# Altium project Connected_Cube.PrjPcb
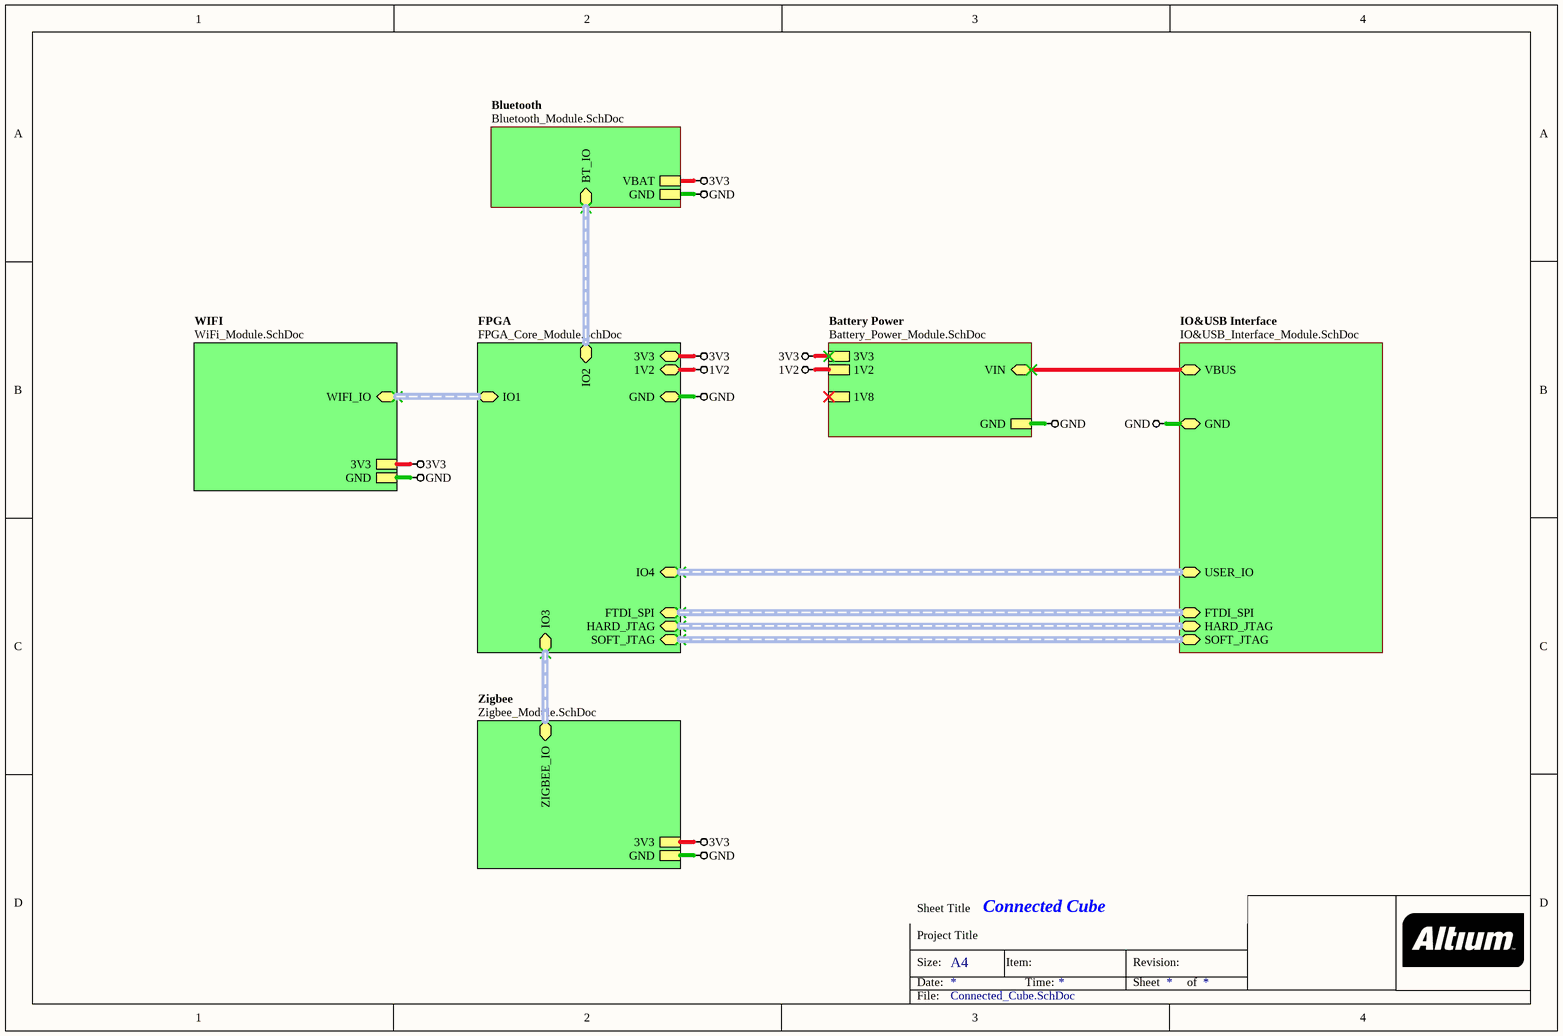
[diagram p0: Connected_Cube.SchDoc]
7 sheets, 1 parts. Net scope: hierarchical (ports join the sheet entries above them; power ports are global).
Board file: Connected_Cube.PcbDoc
Sheets:
  Connected_Cube.SchDoc
    FPGA = FPGA_Core_Module.SchDoc
    Zigbee = Zigbee_Module.SchDoc
    Battery Power = Battery_Power_Module.SchDoc
    IO&USB Interface = IO&USB_Interface_Module.SchDoc
    WIFI = WiFi_Module.SchDoc
    Bluetooth = Bluetooth_Module.SchDoc

## Sheet Connected_Cube.SchDoc: Connected Cube
size A4

### Sub-sheets
Battery Power = Battery_Power_Module.SchDoc: 3V3, GND, 1V8, 1V2, VIN
Bluetooth = Bluetooth_Module.SchDoc: VBAT, GND, BT_IO (harness SIG4)
FPGA = FPGA_Core_Module.SchDoc: 3V3, 1V2, GND, FTDI_SPI (harness FTDI_SPI), HARD_JTAG (harness JTAG_A), SOFT_JTAG (harness JTAG_A), IO3 (harness SIG20), IO4 (harness SIG10), IO1 (harness SIG8), IO2 (harness SIG4)
IO&USB Interface = IO&USB_Interface_Module.SchDoc: VBUS, GND, HARD_JTAG (harness JTAG_A), SOFT_JTAG (harness JTAG_A), USER_IO (harness SIG10), FTDI_SPI (harness FTDI_SPI)
WIFI = WiFi_Module.SchDoc: 3V3, GND, WIFI_IO (harness SIG8)
Zigbee = Zigbee_Module.SchDoc: 3V3, GND, ZIGBEE_IO (harness SIG20)

### Nets
1V2: sheet FPGA/1V2, sheet Battery Power/1V2
3V3: sheet FPGA/3V3, sheet Zigbee/3V3, sheet Battery Power/3V3, sheet WIFI/3V3, sheet Bluetooth/VBAT
GND: sheet FPGA/GND, sheet Zigbee/GND, sheet Battery Power/GND, sheet IO&USB Interface/GND, sheet WIFI/GND, sheet Bluetooth/GND
VBUS: sheet Battery Power/VIN, sheet IO&USB Interface/VBUS

### Buses and harness runs
harness sheet Bluetooth/BT_IO = sheet FPGA/IO2
harness sheet FPGA/FTDI_SPI = sheet IO&USB Interface/FTDI_SPI
harness sheet FPGA/HARD_JTAG = sheet IO&USB Interface/HARD_JTAG
harness sheet FPGA/IO1 = sheet WIFI/WIFI_IO
harness sheet FPGA/IO3 = sheet Zigbee/ZIGBEE_IO
harness sheet FPGA/IO4 = sheet IO&USB Interface/USER_IO
harness sheet FPGA/SOFT_JTAG = sheet IO&USB Interface/SOFT_JTAG

### Notes on the sheet
- Sheet Title
- Project Title
- Size:
- Date:
- A4
- Item:
- Time:
- Revision:
- Sheet
- of
- File:

## Sheet FPGA_Core_Module.SchDoc: FPGA Core Module
size A4
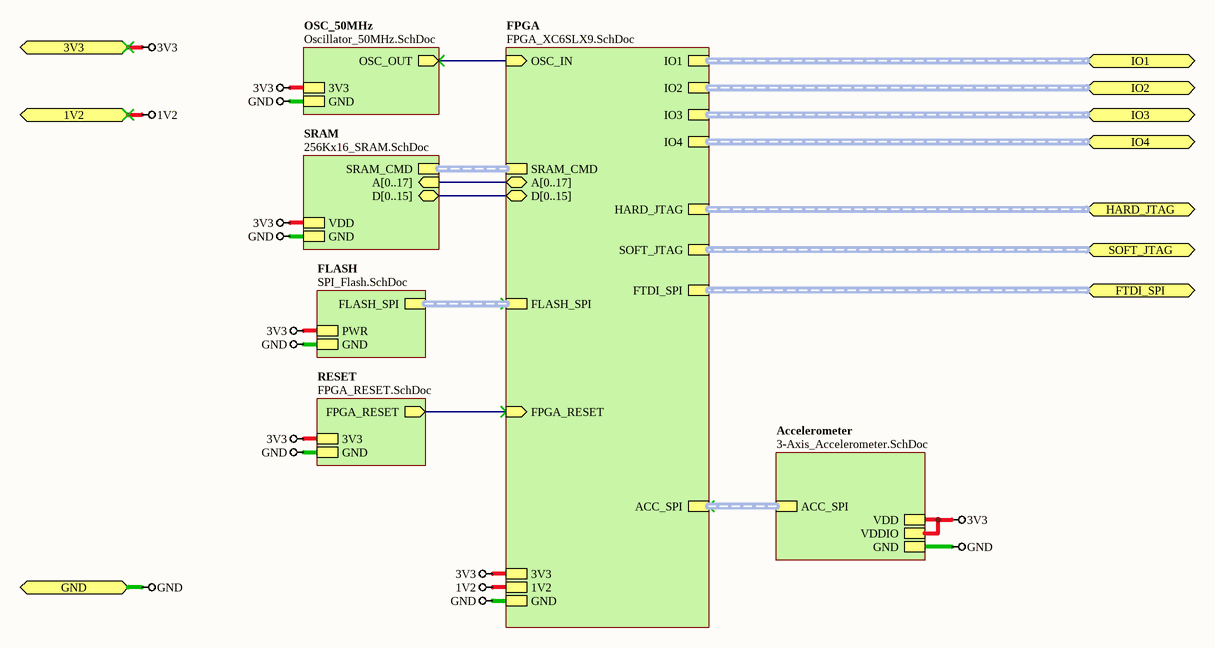
[diagram p1: FPGA_Core_Module.SchDoc]

### Sub-sheets
Accelerometer = 3-Axis_Accelerometer.SchDoc (file not in this document): VDD, VDDIO, GND, ACC_SPI (harness ACC_SPI)
FLASH = SPI_Flash.SchDoc (file not in this document): FLASH_SPI (harness FLASH_SPI), PWR, GND
FPGA = FPGA_XC6SLX9.SchDoc (file not in this document): SRAM_CMD (harness SRAM_CMD), A[0..17] (bidir), D[0..15] (bidir), IO1 (harness SIG8), 3V3, GND, 1V2, OSC_IN (in), FPGA_RESET (in), IO2 (harness SIG4), IO3 (harness SIG20), HARD_JTAG (harness JTAG_A), SOFT_JTAG (harness JTAG_A), FTDI_SPI (harness FTDI_SPI), IO4 (harness SIG10), ACC_SPI (harness ACC_SPI), FLASH_SPI (harness FLASH_SPI)
OSC_50MHz = Oscillator_50MHz.SchDoc (file not in this document): 3V3, OSC_OUT (out), GND
RESET = FPGA_RESET.SchDoc (file not in this document): FPGA_RESET (out), GND, 3V3
SRAM = 256Kx16_SRAM.SchDoc (file not in this document): GND, VDD, A[0..17] (in), D[0..15] (bidir), SRAM_CMD (harness SRAM_CMD)

### Ports
1V2, 3V3, FTDI_SPI (harness FTDI_SPI), GND, HARD_JTAG (harness JTAG_A), IO1 (harness SIG8), IO2 (harness SIG4), IO3 (harness SIG20), IO4 (harness SIG10), SOFT_JTAG (harness JTAG_A)

### Nets
1V2: port 1V2, sheet FPGA/1V2
3V3: port 3V3, sheet RESET/3V3, sheet SRAM/VDD, sheet OSC_50MHz/3V3, sheet FLASH/PWR, sheet Accelerometer/VDD, sheet Accelerometer/VDDIO, sheet FPGA/3V3
GND: port GND, sheet RESET/GND, sheet SRAM/GND, sheet OSC_50MHz/GND, sheet FLASH/GND, sheet Accelerometer/GND, sheet FPGA/GND
(unnamed): sheet RESET/FPGA_RESET, sheet FPGA/FPGA_RESET
(unnamed): sheet OSC_50MHz/OSC_OUT, sheet FPGA/OSC_IN

### Buses and harness runs
bus sheet FPGA/A[0..17] = sheet SRAM/A[0..17]
bus sheet FPGA/D[0..15] = sheet SRAM/D[0..15]
harness port FTDI_SPI = sheet FPGA/FTDI_SPI
harness port HARD_JTAG = sheet FPGA/HARD_JTAG
harness port IO1 = sheet FPGA/IO1
harness port IO2 = sheet FPGA/IO2
harness port IO3 = sheet FPGA/IO3
harness port IO4 = sheet FPGA/IO4
harness port SOFT_JTAG = sheet FPGA/SOFT_JTAG
harness sheet Accelerometer/ACC_SPI = sheet FPGA/ACC_SPI
harness sheet FLASH/FLASH_SPI = sheet FPGA/FLASH_SPI
harness sheet FPGA/SRAM_CMD = sheet SRAM/SRAM_CMD

### Notes on the sheet
- Sheet Title
- Project Title
- Size:
- Date:
- A4
- Item:
- Time:
- Revision:
- Sheet
- of
- File:

## Sheet Zigbee_Module.SchDoc: Zigbee Module
size A4
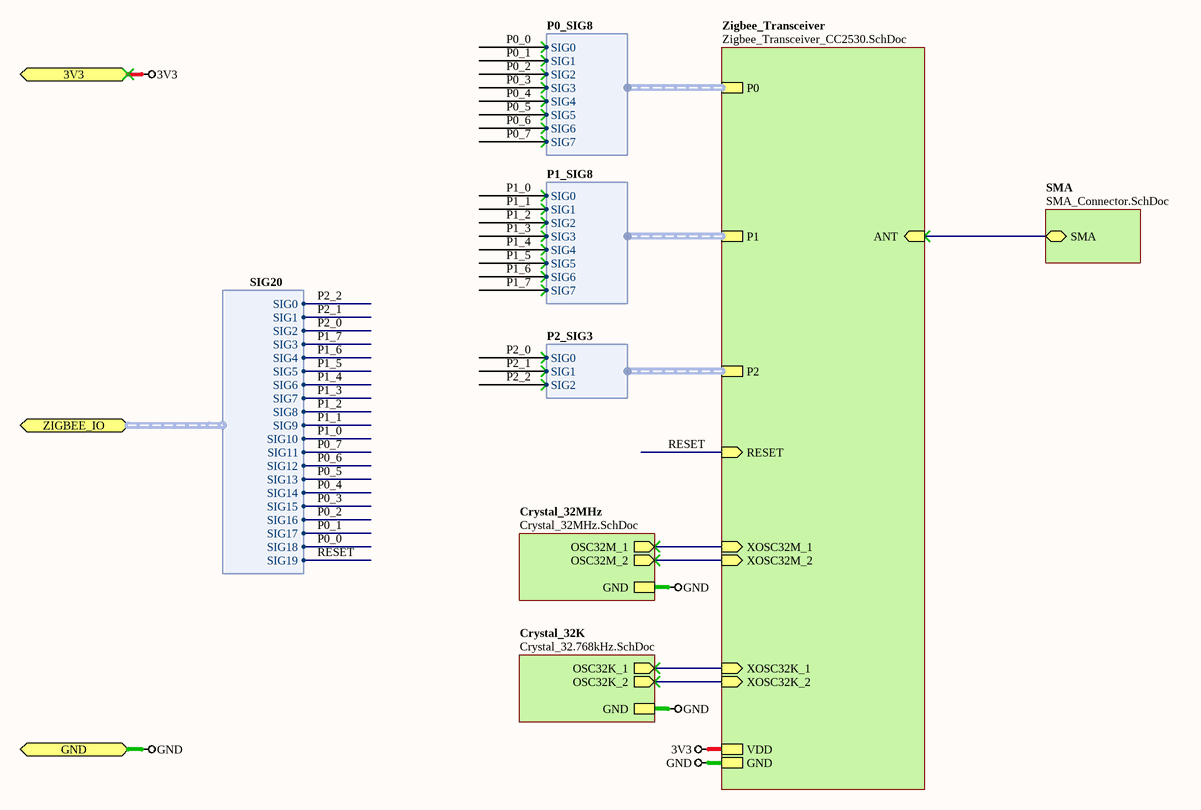
[diagram p2: Zigbee_Module.SchDoc]

### Sub-sheets
Crystal_32K = Crystal_32.768kHz.SchDoc (file not in this document): GND, OSC32K_1 (out), OSC32K_2 (out)
Crystal_32MHz = Crystal_32MHz.SchDoc (file not in this document): OSC32M_1 (out), GND, OSC32M_2 (out)
SMA = SMA_Connector.SchDoc (file not in this document): SMA (bidir)
Zigbee_Transceiver = Zigbee_Transceiver_CC2530.SchDoc (file not in this document): XOSC32M_1 (in), XOSC32M_2 (in), ANT (in), XOSC32K_1 (in), XOSC32K_2 (in), VDD, GND, RESET (in), P0 (harness P0_SIG8), P1 (harness P1_SIG8), P2 (harness P2_SIG3)

### Ports
3V3, GND, ZIGBEE_IO (harness SIG20)

### Harnesses
SIG20: SIG0, SIG1, SIG2, SIG3, SIG4, SIG5, SIG6, SIG7, SIG8, SIG9, SIG10, SIG11, SIG12, SIG13, SIG14, SIG15, SIG16, SIG17, SIG18, SIG19
P0_SIG8: SIG0, SIG1, SIG2, SIG3, SIG4, SIG5, SIG6, SIG7
P1_SIG8: SIG0, SIG1, SIG2, SIG3, SIG4, SIG5, SIG6, SIG7
P2_SIG3: SIG0, SIG1, SIG2

### Nets
3V3: port 3V3, sheet Zigbee_Transceiver/VDD
GND: port GND, sheet Crystal_32K/GND, sheet Crystal_32MHz/GND, sheet Zigbee_Transceiver/GND
P0_0: port ZIGBEE_IO.SIG18, sheet Zigbee_Transceiver/P0.SIG0
P0_1: port ZIGBEE_IO.SIG17, sheet Zigbee_Transceiver/P0.SIG1
P0_2: port ZIGBEE_IO.SIG16, sheet Zigbee_Transceiver/P0.SIG2
P0_3: port ZIGBEE_IO.SIG15, sheet Zigbee_Transceiver/P0.SIG3
P0_4: port ZIGBEE_IO.SIG14, sheet Zigbee_Transceiver/P0.SIG4
P0_5: port ZIGBEE_IO.SIG13, sheet Zigbee_Transceiver/P0.SIG5
P0_6: port ZIGBEE_IO.SIG12, sheet Zigbee_Transceiver/P0.SIG6
P0_7: port ZIGBEE_IO.SIG11, sheet Zigbee_Transceiver/P0.SIG7
P1_0: port ZIGBEE_IO.SIG10, sheet Zigbee_Transceiver/P1.SIG0
P1_1: port ZIGBEE_IO.SIG9, sheet Zigbee_Transceiver/P1.SIG1
P1_2: port ZIGBEE_IO.SIG8, sheet Zigbee_Transceiver/P1.SIG2
P1_3: port ZIGBEE_IO.SIG7, sheet Zigbee_Transceiver/P1.SIG3
P1_4: port ZIGBEE_IO.SIG6, sheet Zigbee_Transceiver/P1.SIG4
P1_5: port ZIGBEE_IO.SIG5, sheet Zigbee_Transceiver/P1.SIG5
P1_6: port ZIGBEE_IO.SIG4, sheet Zigbee_Transceiver/P1.SIG6
P1_7: port ZIGBEE_IO.SIG3, sheet Zigbee_Transceiver/P1.SIG7
P2_0: port ZIGBEE_IO.SIG2, sheet Zigbee_Transceiver/P2.SIG0
P2_1: port ZIGBEE_IO.SIG1, sheet Zigbee_Transceiver/P2.SIG1
P2_2: port ZIGBEE_IO.SIG0, sheet Zigbee_Transceiver/P2.SIG2
RESET: sheet Zigbee_Transceiver/RESET, port ZIGBEE_IO.SIG19
(unnamed): sheet SMA/SMA, sheet Zigbee_Transceiver/ANT
(unnamed): sheet Crystal_32K/OSC32K_1, sheet Zigbee_Transceiver/XOSC32K_1
(unnamed): sheet Crystal_32K/OSC32K_2, sheet Zigbee_Transceiver/XOSC32K_2
(unnamed): sheet Crystal_32MHz/OSC32M_1, sheet Zigbee_Transceiver/XOSC32M_1
(unnamed): sheet Crystal_32MHz/OSC32M_2, sheet Zigbee_Transceiver/XOSC32M_2

### Notes on the sheet
- Sheet Title
- Project Title
- Size:
- Date:
- A4
- Item:
- Time:
- Revision:
- Sheet
- of
- File:

## Sheet Battery_Power_Module.SchDoc: Battery Power Module
size A4
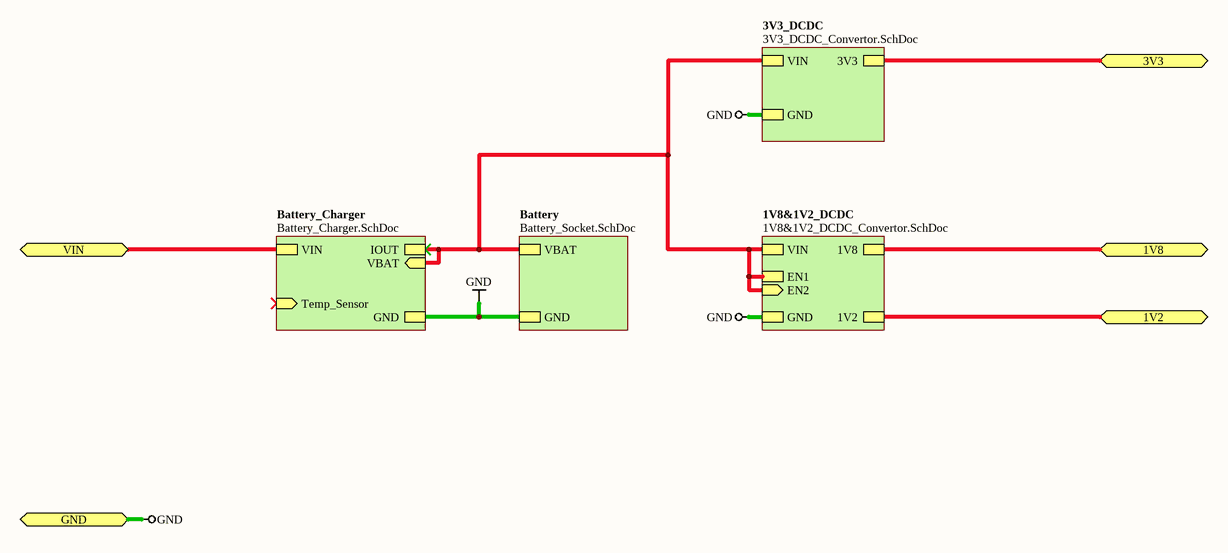
[diagram p3: Battery_Power_Module.SchDoc]

### Sub-sheets
1V8&1V2_DCDC = 1V8&1V2_DCDC_Convertor.SchDoc (file not in this document): VIN, EN1, EN2 (in), GND, 1V8, 1V2
3V3_DCDC = 3V3_DCDC_Convertor.SchDoc (file not in this document): VIN, GND, 3V3
Battery = Battery_Socket.SchDoc (file not in this document): VBAT, GND
Battery_Charger = Battery_Charger.SchDoc (file not in this document): VIN, GND, Temp_Sensor (in), VBAT (in), IOUT

### Ports
1V2, 1V8, 3V3, GND, VIN

### Nets
1V2: port 1V2, sheet 1V8&1V2_DCDC/1V2
3V3: port 3V3, sheet 3V3_DCDC/3V3
GND: port GND, sheet 3V3_DCDC/GND, sheet 1V8&1V2_DCDC/GND, sheet Battery/GND, sheet Battery_Charger/GND
VBUS: port VIN, sheet Battery_Charger/VIN
(unnamed): port 1V8, sheet 1V8&1V2_DCDC/1V8
(unnamed): sheet 3V3_DCDC/VIN, sheet 1V8&1V2_DCDC/VIN, sheet 1V8&1V2_DCDC/EN1, sheet 1V8&1V2_DCDC/EN2, sheet Battery/VBAT, sheet Battery_Charger/VBAT, sheet Battery_Charger/IOUT

### Notes on the sheet
- Sheet Title
- Project Title
- Size:
- Date:
- A4
- Item:
- Time:
- Revision:
- Sheet
- of
- File:

## Sheet IO&USB_Interface_Module.SchDoc: IO&USB Interface Module
size A4
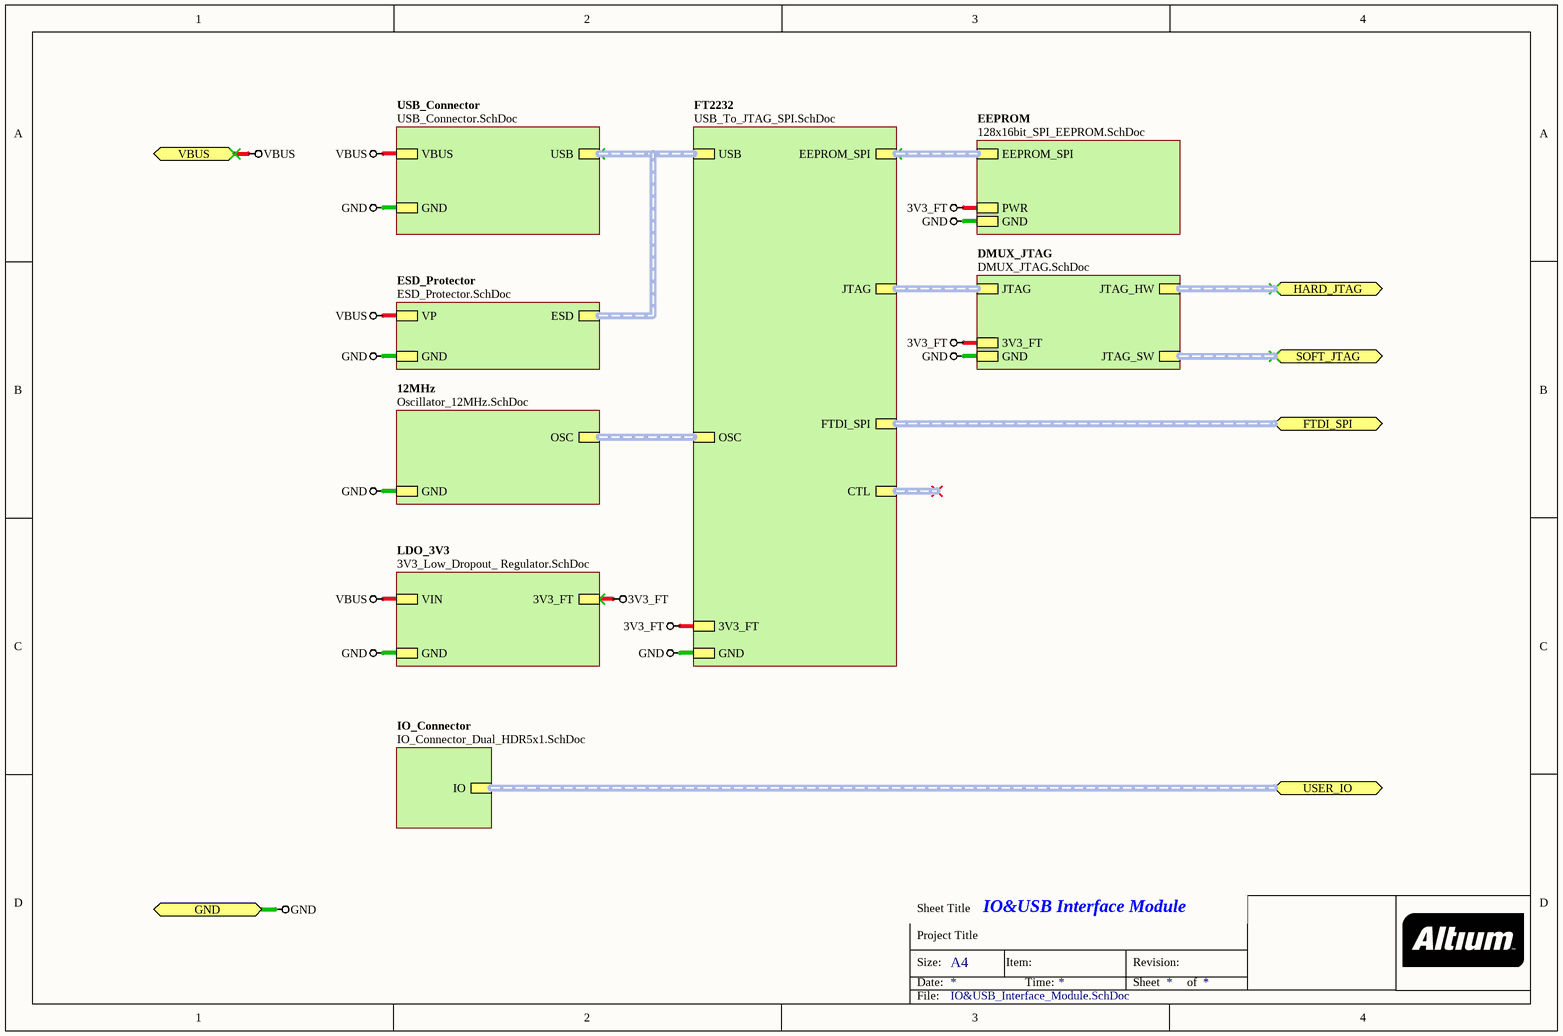
[diagram p4: IO&USB_Interface_Module.SchDoc]

### Sub-sheets
12MHz = Oscillator_12MHz.SchDoc (file not in this document): OSC (harness OSC), GND
DMUX_JTAG = DMUX_JTAG.SchDoc (file not in this document): JTAG_SW (harness JTAG_SW), JTAG_HW (harness JTAG_HW), GND, 3V3_FT, JTAG (harness JTAG)
EEPROM = 128x16bit_SPI_EEPROM.SchDoc (file not in this document): EEPROM_SPI (harness FTDI_SPI), GND, PWR
ESD_Protector = ESD_Protector.SchDoc (file not in this document): VP, GND, ESD (harness USB)
FT2232 = USB_To_JTAG_SPI.SchDoc (file not in this document): USB (harness USB), EEPROM_SPI (harness EEPROM_SPI), 3V3_FT, GND, OSC (harness OSC), FTDI_SPI (harness FTDI_SPI), JTAG (harness JTAG), CTL (harness CTL)
IO_Connector = IO_Connector_Dual_HDR5x1.SchDoc (file not in this document): IO (harness SIG10)
LDO_3V3 = 3V3_Low_Dropout_ Regulator.SchDoc (file not in this document): 3V3_FT, VIN, GND
USB_Connector = USB_Connector.SchDoc (file not in this document): VBUS, GND, USB (harness USB)

### Ports
FTDI_SPI (harness FTDI_SPI), GND, HARD_JTAG (harness JTAG_A), SOFT_JTAG (harness JTAG_A), USER_IO (harness SIG10), VBUS

### Nets
3V3_FT: sheet FT2232/3V3_FT, sheet DMUX_JTAG/3V3_FT, sheet EEPROM/PWR, sheet LDO_3V3/3V3_FT
GND: port GND, sheet FT2232/GND, sheet 12MHz/GND, sheet DMUX_JTAG/GND, sheet EEPROM/GND, sheet LDO_3V3/GND, sheet USB_Connector/GND, sheet ESD_Protector/GND
VBUS: port VBUS, sheet LDO_3V3/VIN, sheet USB_Connector/VBUS, sheet ESD_Protector/VP

### Buses and harness runs
harness port FTDI_SPI = sheet FT2232/FTDI_SPI
harness port HARD_JTAG = sheet DMUX_JTAG/JTAG_HW
harness port SOFT_JTAG = sheet DMUX_JTAG/JTAG_SW
harness port USER_IO = sheet IO_Connector/IO
harness sheet 12MHz/OSC = sheet FT2232/OSC
harness sheet DMUX_JTAG/JTAG = sheet FT2232/JTAG
harness sheet EEPROM/EEPROM_SPI = sheet FT2232/EEPROM_SPI
harness sheet ESD_Protector/ESD = sheet FT2232/USB = sheet USB_Connector/USB

### Notes on the sheet
- Sheet Title
- Project Title
- Size:
- Date:
- A4
- Item:
- Time:
- Revision:
- Sheet
- of
- File:

## Sheet WiFi_Module.SchDoc: WiFi Module
size A4
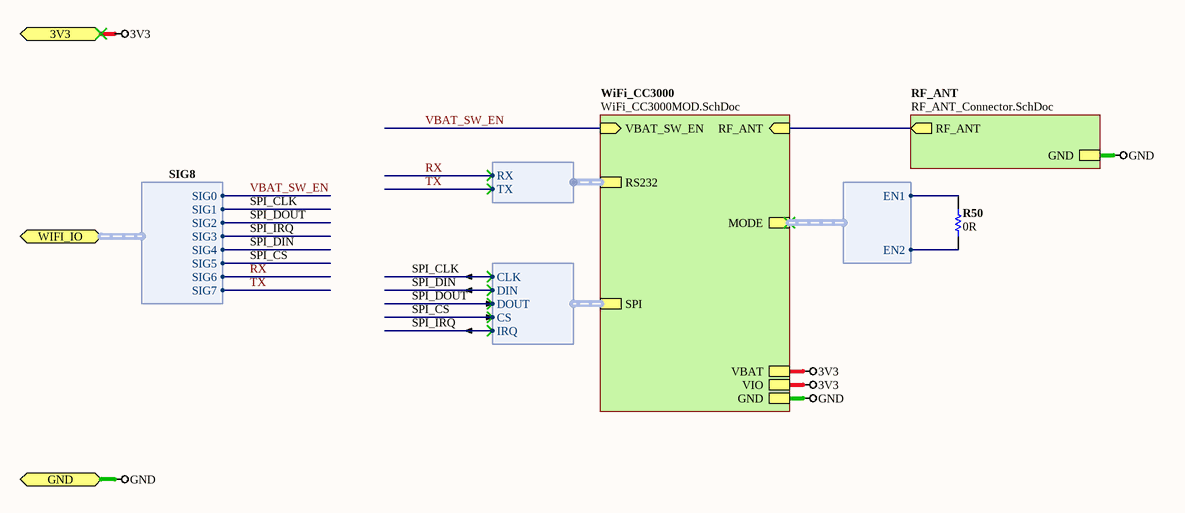
[diagram p5: WiFi_Module.SchDoc]

### Parts
R50  0R  [RESC0402(1005)_N]

### Sub-sheets
RF_ANT = RF_ANT_Connector.SchDoc (file not in this document): RF_ANT (out), GND
WiFi_CC3000 = WiFi_CC3000MOD.SchDoc (file not in this document): GND, VBAT, RS232 (harness RS232), SPI (harness SPI_CC3000), VBAT_SW_EN (in), RF_ANT (in), VIO, MODE (harness MODE_CC3000)

### Ports
3V3, GND, WIFI_IO (harness SIG8)

### Harnesses
RS232: RX, TX
SPI_CC3000: CLK, DIN, DOUT, CS, IRQ
SIG8: SIG0, SIG1, SIG2, SIG3, SIG4, SIG5, SIG6, SIG7
MODE_CC3000: EN1, EN2

### Nets
3V3: port 3V3, sheet WiFi_CC3000/VBAT, sheet WiFi_CC3000/VIO
GND: port GND, sheet WiFi_CC3000/GND, sheet RF_ANT/GND
RX: sheet WiFi_CC3000/RS232.RX, port WIFI_IO.SIG6
SPI_CLK: sheet WiFi_CC3000/SPI.CLK, port WIFI_IO.SIG1
SPI_CS: sheet WiFi_CC3000/SPI.CS, port WIFI_IO.SIG5
SPI_DIN: sheet WiFi_CC3000/SPI.DIN, port WIFI_IO.SIG4
SPI_DOUT: sheet WiFi_CC3000/SPI.DOUT, port WIFI_IO.SIG2
SPI_IRQ: sheet WiFi_CC3000/SPI.IRQ, port WIFI_IO.SIG3
TX: sheet WiFi_CC3000/RS232.TX, port WIFI_IO.SIG7
VBAT_SW_EN: sheet WiFi_CC3000/VBAT_SW_EN, port WIFI_IO.SIG0
NetR50_1: R50.1 ; sheet WiFi_CC3000/MODE.EN2
NetR50_2: R50.2 ; sheet WiFi_CC3000/MODE.EN1
(unnamed): sheet WiFi_CC3000/RF_ANT, sheet RF_ANT/RF_ANT

### Notes on the sheet
- Sheet Title
- Project Title
- Size:
- Date:
- A4
- Item:
- Time:
- Revision:
- Sheet
- of
- File:

### Library data of the parts
R50 = CMP-1011-00001-1: Jumper 0402 (1005 Metric); Tolerance: None; Case-Metric: 1005; Case-EIA: 0402; Value: 0.00 Ohm; Power: None; Technology: SMT

## Sheet Bluetooth_Module.SchDoc: Bluetooth Module
size A4
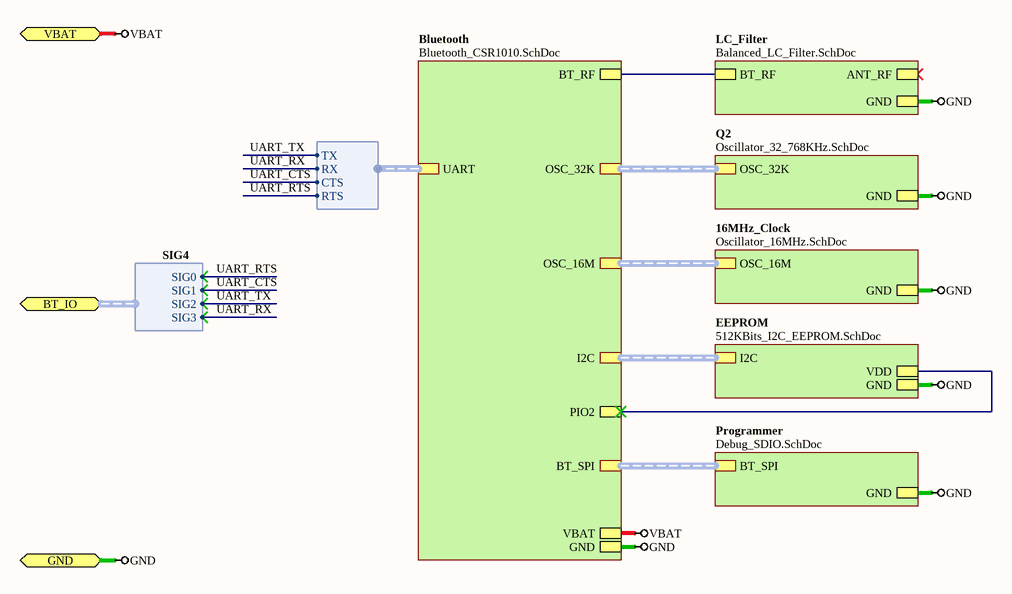
[diagram p6: Bluetooth_Module.SchDoc]

### Sub-sheets
16MHz_Clock = Oscillator_16MHz.SchDoc (file not in this document): GND, OSC_16M (harness OSC)
Bluetooth = Bluetooth_CSR1010.SchDoc (file not in this document): BT_RF, VBAT, GND, UART (harness UART_HS), I2C (harness I2C), BT_SPI (harness SPI_CSR1010), PIO2, OSC_32K (harness OSC), OSC_16M (harness OSC)
EEPROM = 512KBits_I2C_EEPROM.SchDoc (file not in this document): GND, VDD, I2C (harness I2C)
LC_Filter = Balanced_LC_Filter.SchDoc (file not in this document): BT_RF, GND, ANT_RF
Programmer = Debug_SDIO.SchDoc (file not in this document): GND, BT_SPI (harness SPI_CSR1010)
Q2 = Oscillator_32_768KHz.SchDoc (file not in this document): GND, OSC_32K (harness OSC)

### Ports
BT_IO (harness SIG4), GND, VBAT

### Harnesses
SIG4: SIG0, SIG1, SIG2, SIG3
UART_HS: RX, RTS, TX, CTS

### Nets
GND: port GND, sheet Programmer/GND, sheet EEPROM/GND, sheet LC_Filter/GND, sheet Q2/GND, sheet 16MHz_Clock/GND, sheet Bluetooth/GND
VBAT: port VBAT, sheet Bluetooth/VBAT  [project net 3V3]
UART_CTS: port BT_IO.SIG1, sheet Bluetooth/UART.CTS
UART_RTS: port BT_IO.SIG0, sheet Bluetooth/UART.RTS
UART_RX: port BT_IO.SIG3, sheet Bluetooth/UART.RX
UART_TX: port BT_IO.SIG2, sheet Bluetooth/UART.TX
(unnamed): sheet EEPROM/VDD, sheet Bluetooth/PIO2
(unnamed): sheet LC_Filter/BT_RF, sheet Bluetooth/BT_RF

### Buses and harness runs
harness sheet 16MHz_Clock/OSC_16M = sheet Bluetooth/OSC_16M
harness sheet Bluetooth/BT_SPI = sheet Programmer/BT_SPI
harness sheet Bluetooth/I2C = sheet EEPROM/I2C
harness sheet Bluetooth/OSC_32K = sheet Q2/OSC_32K

### Notes on the sheet
- Sheet Title
- Project Title
- Size:
- Date:
- A4
- Item:
- Time:
- Revision:
- Sheet
- of
- File: